# Altium schematic sheet boadr.SchDoc
size A0
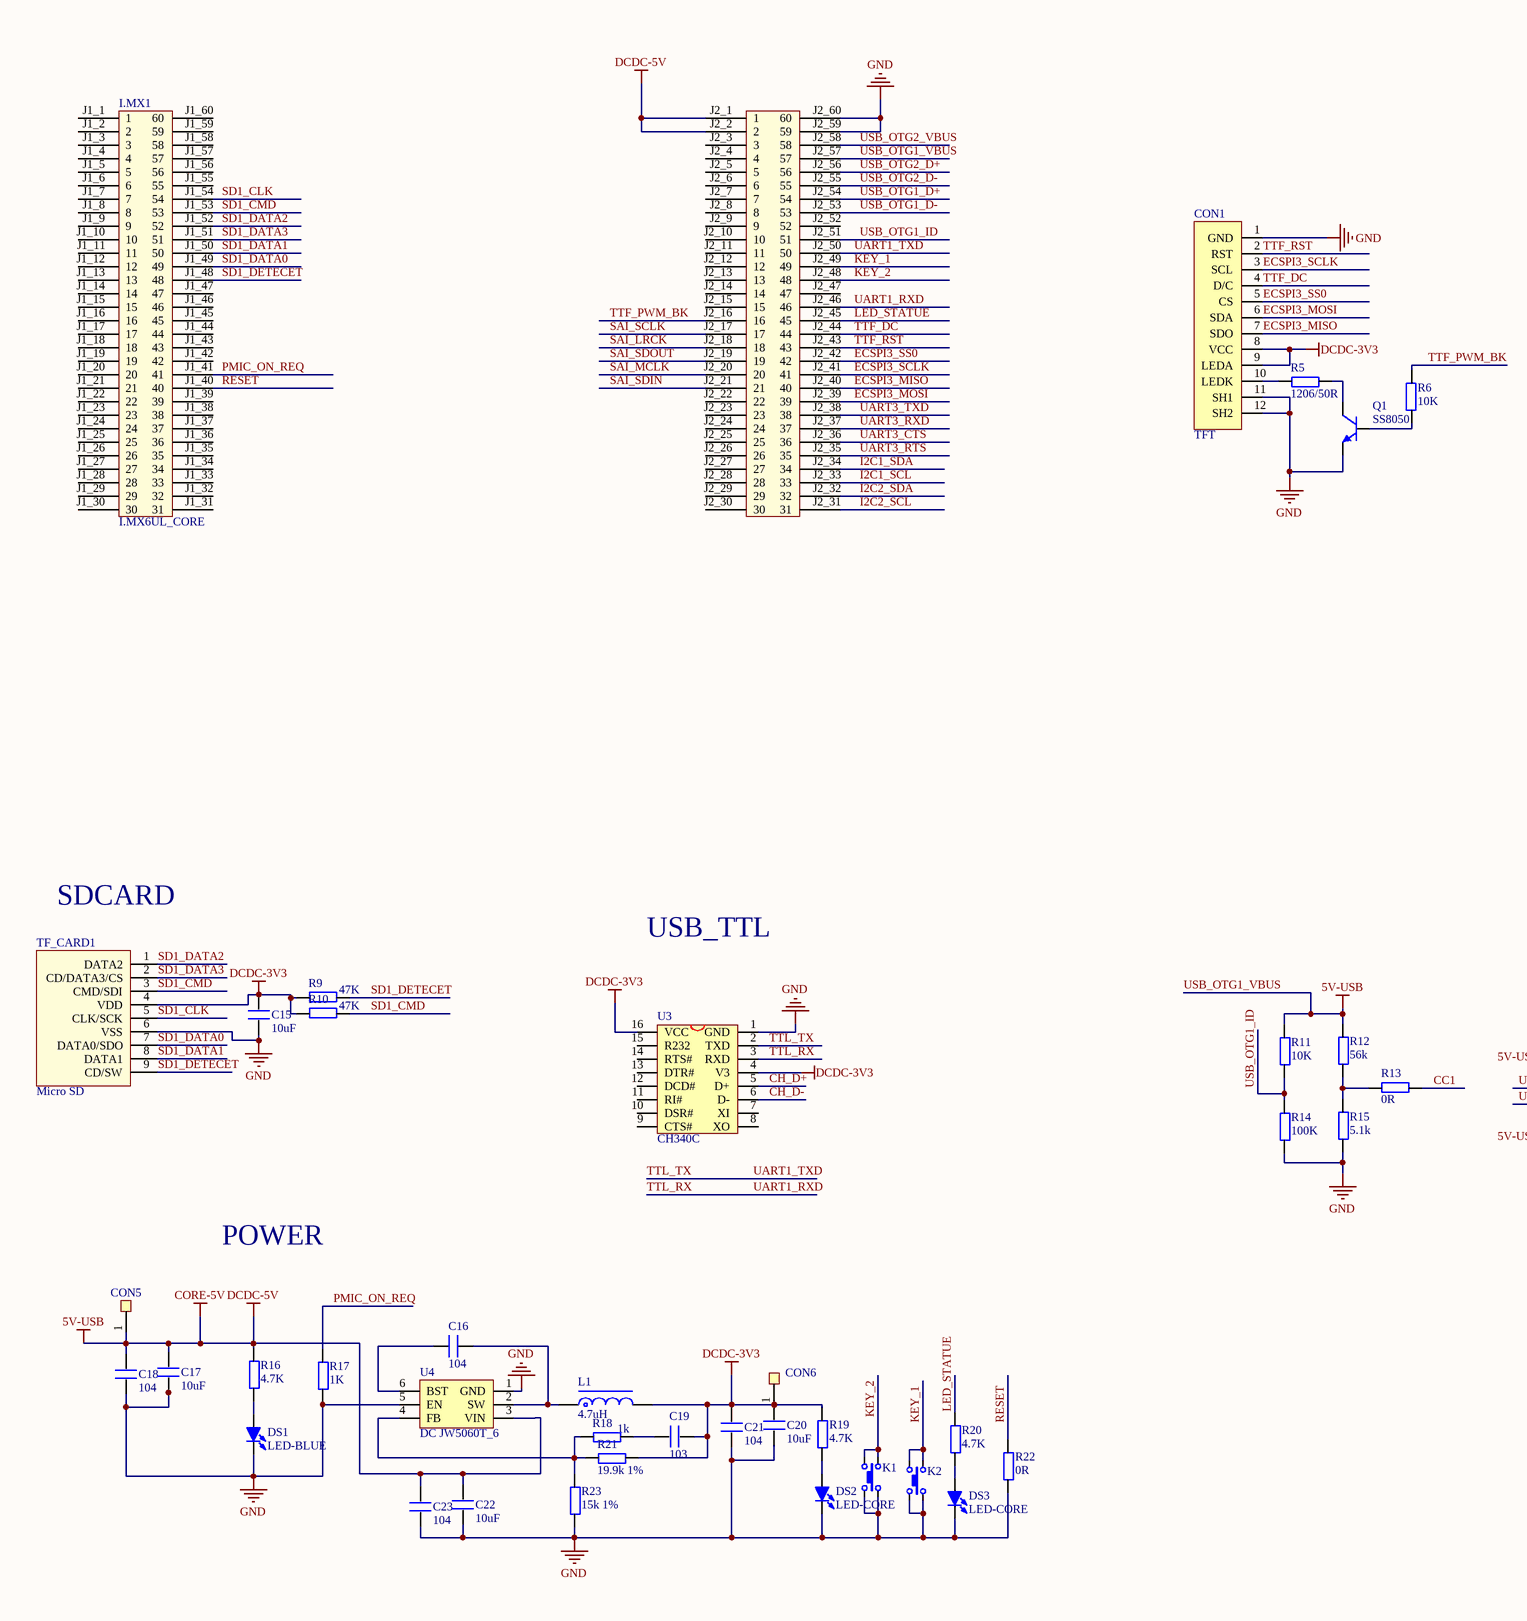
[diagram p0: boadr.SchDoc, left]
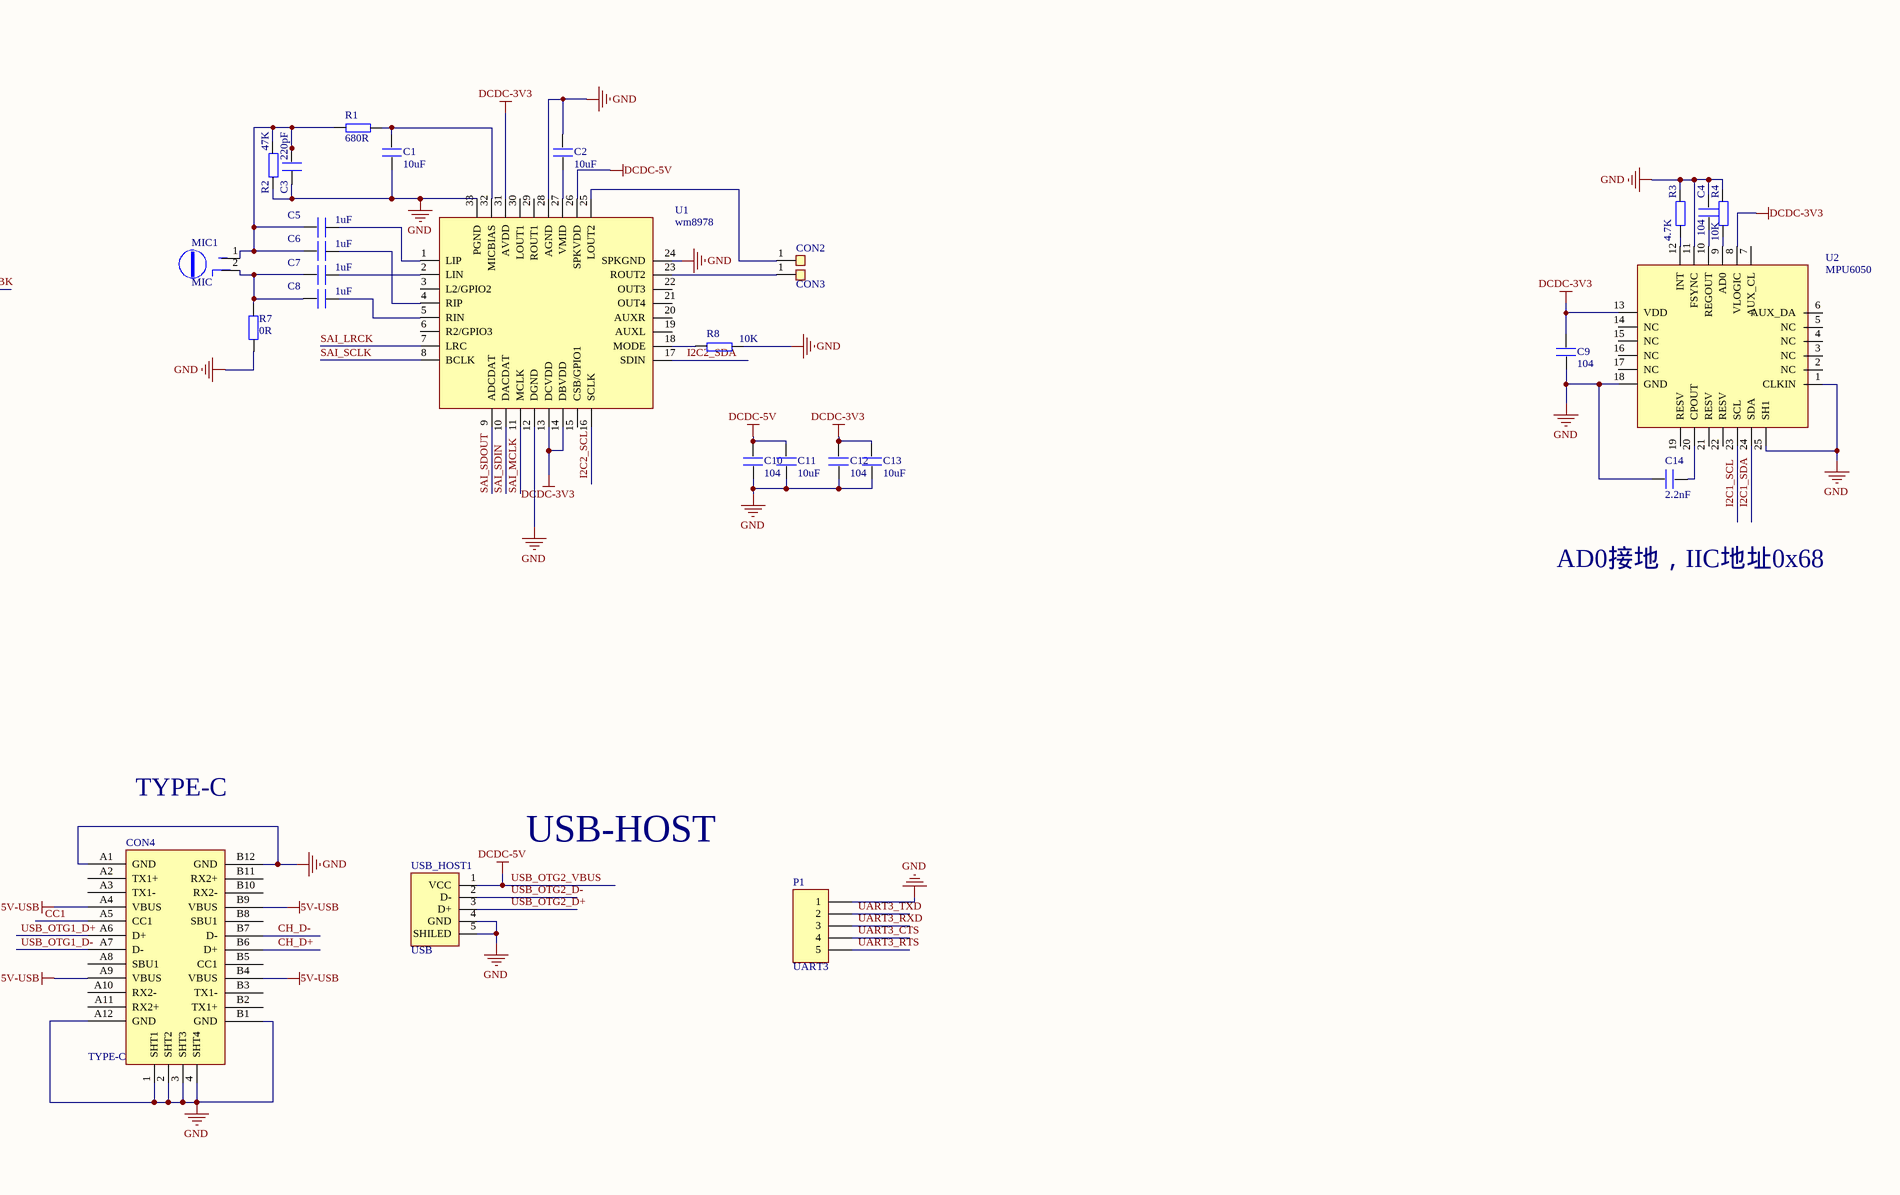
[diagram p1: boadr.SchDoc, right]

## Parts
C1  10uF  [C 0603]
C2  10uF  [C 0603]
C3  220pF  [C 0603]
C4  104  [C 0603]
C5  1uF  [C 0603]
C6  1uF  [C 0603]
C7  1uF  [C 0603]
C8  1uF  [C 0603]
C9  104  [C 0603]
C10  104  [C 0603]
C11  10uF  [C 0603]
C12  104  [C 0603]
C13  10uF  [C 0603]
C14  2.2nF  [C 0603]
C15  10uF  [C 0603]
C16  104  [C 0603]
C17  10uF  [C 0603]
C18  104  [C 0603]
C19  103  [C 0603]
C20  10uF  [C 0603]
C21  104  [C 0603]
C22  10uF  [C 0603]
C23  104  [C 0603]
CON1  TFT  [FPC连接器]
CON2  connector  [PIN-1-TEST]  (value not drawn)
CON3  connector  [PIN-1-TEST]  (value not drawn)
CON4  TYPE-C  [type-c]
CON5  connector  [PIN-1-TEST]  (value not drawn)
CON6  connector  [PIN-1-TEST]  (value not drawn)
DS1  LED-BLUE  [LED-0603]
DS2  LED-CORE  [LED 0603R]
DS3  LED-CORE  [LED 0603R]
I.MX1  I.MX6UL_CORE  [I.MX6UL_CORE]
K1  TACT 4P  [DS-THAM04-ABB-R]  (value not drawn)
K2  TACT 4P  [DS-THAM04-ABB-R]  (value not drawn)
L1  4.7uH  [L-SMD-0420]
MIC1  MIC  [MIC-6022]
P1  UART3  [CON-1.27*5]
Q1  SS8050  [SOT23-3N]
R1  680R  [R 0603]
R2  47K  [R 0603]
R3  4.7K  [R 0603]
R4  10K  [R 0603]
R5  1206/50R  [0805]
R6  10K  [R 0603]
R7  0R  [R 0603]
R8  10K  [R 0603]
R9  47K  [R 0603]
R10  47K  [R 0603]
R11  10K  [R 0603]
R12  56k  [R 0603]
R13  0R  [R 0603]
R14  100K  [R 0603]
R15  5.1k  [R 0603]
R16  4.7K  [R 0603]
R17  1K  [R 0603]
R18  1k  [R 0603]
R19  4.7K  [R 0603]
R20  4.7K  [R 0603]
R21  19.9k 1%  [R 0603]
R22  0R  [R 0603]
R23  15k 1%  [R 0603]
TF_CARD1  Micro SD  [Micro SD]
U1  wm8978  [QFN50P500X500X80_HS-33N]
U2  MPU6050  [QFN50P400X400X90_HS-25N]
U3  CH340C  [SOP16_N]
U4  DC JW5060T_6  [SOT23-6N]
USB_HOST1  USB  [USB-A/S_C]

## Nets
DCDC-3V3: C9.1 C12.1 C13.1 C15.2 C19.1 C20.2 C21.2 CON1.8(VCC) CON1.9(LEDA) CON6.1 L1.2 R9.2 R10.2 R19.2 R21.2 TF_CARD1.4(VDD) U1.13(DCVDD) U1.14(DBVDD) U1.31(AVDD) U2.8(VLOGIC) U2.13(VDD) U3.4(V3) U3.16(VCC)
GND: C1.2 C2.1 C3.2 C4.1 C9.2 C10.2 C11.2 C12.2 C13.2 C14.1 C15.1 C17.1 C18.1 C20.1 C21.1 C22.1 C23.1 CON1.1(GND) CON1.11(SH1) CON1.12(SH2) CON4.1(SHT1) CON4.2(SHT2) CON4.3(SHT3) CON4.4(SHT4) CON4.A1(GND) CON4.A12(GND) CON4.B1(GND) CON4.B12(GND) DS1.2(K) DS2.2(K) DS3.2(K) I.MX1.J2_59(59) I.MX1.J2_60(60) K1.1 K1.3 K2.1 K2.3 P1.1 Q1.2(E) R2.1 R3.2 R4.2 R7.2 R8.2 R14.1 R15.1 R17.1 R22.1 R23.1 TF_CARD1.6(VSS) U1.12(DGND) U1.24(SPKGND) U1.28(AGND) U1.33(PGND) U2.1(CLKIN) U2.11(FSYNC) U2.18(GND) U2.25(SH1) U3.1(GND) U4.1(GND) U4.5(EN) USB_HOST1.4(GND) USB_HOST1.5(SHILED)
USB_OTG1_VBUS: C10.1 C11.1 C17.2 C18.2 C22.2 C23.2 CON4.A4(VBUS) CON4.A9(VBUS) CON4.B4(VBUS) CON4.B9(VBUS) CON5.1 I.MX1.J2_1(1) I.MX1.J2_2(2) I.MX1.J2_57(57) I.MX1.J2_58(58) R11.2 R12.2 R16.2 U1.26(SPKVDD) U4.3(VIN) USB_HOST1.1(VCC)  [also labelled 5V-USB, CORE-5V, DCDC-5V, USB_OTG2_VBUS]
CC1: CON4.A5(CC1) R13.1
CH_D+: CON4.B6(D+) U3.5(D+)
CH_D-: CON4.B7(D-) U3.6(D-)
ECSPI3_MISO: CON1.7(SDO) I.MX1.J2_40(40)
ECSPI3_MOSI: CON1.6(SDA) I.MX1.J2_39(39)
ECSPI3_SCLK: CON1.3(SCL) I.MX1.J2_41(41)
ECSPI3_SS0: CON1.5(CS) I.MX1.J2_42(42)
I2C1_SCL: I.MX1.J2_33(33) U2.23(SCL)
I2C1_SDA: I.MX1.J2_34(34) U2.24(SDA)
I2C2_SCL: I.MX1.J2_31(31) U1.16(SCLK)
I2C2_SDA: I.MX1.J2_32(32) U1.17(SDIN)
KEY_1: I.MX1.J2_49(49) K2.2 K2.4
KEY_2: I.MX1.J2_48(48) K1.2 K1.4
LED_STATUE: I.MX1.J2_45(45) R20.2
PMIC_ON_REQ: I.MX1.J1_41(41) R17.2
RESET: I.MX1.J1_40(40) R22.2
SAI_LRCK: I.MX1.J2_18(18) U1.7(LRC)
SAI_MCLK: I.MX1.J2_20(20) U1.11(MCLK)
SAI_SCLK: I.MX1.J2_17(17) U1.8(BCLK)
SAI_SDIN: I.MX1.J2_21(21) U1.10(DACDAT)
SAI_SDOUT: I.MX1.J2_19(19) U1.9(ADCDAT)
SD1_CLK: I.MX1.J1_54(54) TF_CARD1.5(CLK/SCK)
SD1_CMD: I.MX1.J1_53(53) R10.1 TF_CARD1.3(CMD/SDI)
SD1_DATA0: I.MX1.J1_49(49) TF_CARD1.7(DATA0/SDO)
SD1_DATA1: I.MX1.J1_50(50) TF_CARD1.8(DATA1)
SD1_DATA2: I.MX1.J1_52(52) TF_CARD1.1(DATA2)
SD1_DATA3: I.MX1.J1_51(51) TF_CARD1.2(CD/DATA3/CS)
SD1_DETECET: I.MX1.J1_48(48) R9.1 TF_CARD1.9(CD/SW)
TTF_DC: CON1.4(D/C) I.MX1.J2_44(44)
TTF_PWM_BK: I.MX1.J2_16(16) R6.1
TTF_RST: CON1.2(RST) I.MX1.J2_43(43)
TTL_RX: I.MX1.J2_46(46) U3.3(RXD)  [also labelled UART1_RXD]
TTL_TX: I.MX1.J2_50(50) U3.2(TXD)  [also labelled UART1_TXD]
UART3_CTS: I.MX1.J2_36(36) P1.4
UART3_RTS: I.MX1.J2_35(35) P1.5
UART3_RXD: I.MX1.J2_37(37) P1.3
UART3_TXD: I.MX1.J2_38(38) P1.2
USB_OTG1_D+: CON4.A6(D+) I.MX1.J2_54(54)
USB_OTG1_D-: CON4.A7(D-) I.MX1.J2_53(53)
USB_OTG1_ID: I.MX1.J2_51(51) R11.1 R14.2
USB_OTG2_D+: I.MX1.J2_56(56) USB_HOST1.3(D+)
USB_OTG2_D-: I.MX1.J2_55(55) USB_HOST1.2(D-)
NetC1_1: C1.1 R1.2 U1.32(MICBIAS)
NetC2_2: C2.2 U1.27(VMID)
NetC3_1: C3.1 C5.2 C6.2 MIC1.1(VCC) R1.1 R2.2
NetC4_2: C4.2 U2.10(REGOUT)
NetC5_1: C5.1 U1.1(LIP)
NetC6_1: C6.1 U1.4(RIP)
NetC7_1: C7.1 U1.2(LIN)
NetC7_2: C7.2 C8.2 MIC1.2(GND) R7.1
NetC8_1: C8.1 U1.5(RIN)
NetC14_2: C14.2 U2.20(CPOUT)
NetC16_1: C16.1 U4.6(BST)
NetC16_2: C16.2 L1.1 U4.2(SW)
NetC19_2: C19.2 R18.2
NetCON1_10: CON1.10(LEDK) R5.1
NetCON2_1: CON2.1 U1.25(LOUT2)
NetCON3_1: CON3.1 U1.23(ROUT2)
NetDS1_1: DS1.1(A) R16.1
NetDS2_1: DS2.1(A) R19.1
NetDS3_1: DS3.1(A) R20.1
NetQ1_1: Q1.1(B) R6.2
NetQ1_3: Q1.3(C) R5.2
NetR3_1: R3.1 U2.12(INT)
NetR4_1: R4.1 U2.9(AD0)
NetR8_1: R8.1 U1.18(MODE)
NetR12_1: R12.1 R13.2 R15.2
NetR18_1: R18.1 R21.1 R23.2 U4.4(FB)

Not connected (* = marked no-connect by the designer): CON4 A2(TX1+) A3(TX1-) A8(SBU1) A10(RX2-) A11(RX2+) B2(TX1+) B3(TX1-) B5(CC1) B8(SBU1) B10(RX2-) B11(RX2+); I.MX1 J1_1(1) J1_2(2) J1_3(3) J1_4(4) J1_5(5) J1_6(6) J1_7(7) J1_8(8) J1_9(9) J1_10(10) J1_11(11) J1_12(12) J1_13(13) J1_14(14) J1_15(15) J1_16(16) J1_17(17) J1_18(18) J1_19(19) J1_20(20) J1_21(21) J1_22(22) J1_23(23) J1_24(24) J1_25(25) J1_26(26) J1_27(27) J1_28(28) J1_29(29) J1_30(30) J1_31(31) J1_32(32) J1_33(33) J1_34(34) J1_35(35) J1_36(36) J1_37(37) J1_38(38) J1_39(39) J1_42(42) J1_43(43) J1_44(44) J1_45(45) J1_46(46) J1_47(47) J1_55(55) J1_56(56) J1_57(57) J1_58(58) J1_59(59) J1_60(60) J2_3(3) J2_4(4) J2_5(5) J2_6(6) J2_7(7) J2_8(8) J2_9(9) J2_10(10) J2_11(11) J2_12(12) J2_13(13) J2_14(14) J2_15(15) J2_22(22) J2_23(23) J2_24(24) J2_25(25) J2_26(26) J2_27(27) J2_28(28) J2_29(29) J2_30(30) J2_47(47) J2_52(52); U1 3(L2/GPIO2) 6(R2/GPIO3) 15(CSB/GPIO1) 19(AUXL) 20(AUXR) 21(OUT4) 22(OUT3) 29(ROUT1) 30(LOUT1); U2 2(NC) 3(NC) 4(NC) 5(NC) 6(AUX_DA) 7(AUX_CL) 14(NC) 15(NC) 16(NC) 17(NC) 19(RESV) 21(RESV) 22(RESV); U3 7(XI) 8(XO) 9(CTS#) 10(DSR#) 11(RI#) 12(DCD#) 13(DTR#) 14(RTS#) 15(R232)

## Notes on the sheet
- AD0接地，IIC地址0x68
- (near TF_CARD1) SDCARD
- USB_TTL
- TYPE-C
- USB-HOST
- POWER

## Library data of the parts
C1-C23 = C
CON1 = TFT_SPI_10PIN
CON2 CON3 CON5 CON6 = PIN-1
DS1-DS3 = LED-SMD: 贴片LED; 版权归属: 源创客; BOM名称: 贴片LED; 学习资源: www.ooocke.com
I.MX1 = I.MX6UL核心板
K1 K2 = ButtonTACT: Button; value: 3.4x3.5; type: TACT 4P
L1 = L-CDRH: 功率屏蔽电感; 版权归属: 源创客; BOM名称: 功率屏蔽电感; 学习资源: www.ooocke.com
P1 = Header 5: Header, 5-Pin; LatestRevisionDate: 17-Jul-2002; LatestRevisionNote: Re-released for DXP Platform.; Publisher: Altium Limited
Q1 = 8050-SMD: 高频放大-NPN型; 版权归属: 源创客; 属性: 40V 1.5A 1W 100MHZ; BOM名称: 高频放大-NPN型; 学习资源: www.ooocke.com
R1-R23 = R
TF_CARD1 = Micro SD: Micro SD卡; 版权归属: 源创客; BOM名称: Micro SD卡; 学习资源: www.ooocke.com
U1 = wm8978: 音频
U3 = CH340G: USB2UART
U4 = DC JW5060T_6: DC降压芯片
USB_HOST1 = USB-A/S: USB-A型母接口; 版权归属: 源创客; BOM名称: USB-A型母接口; 学习资源: www.ooocke.com